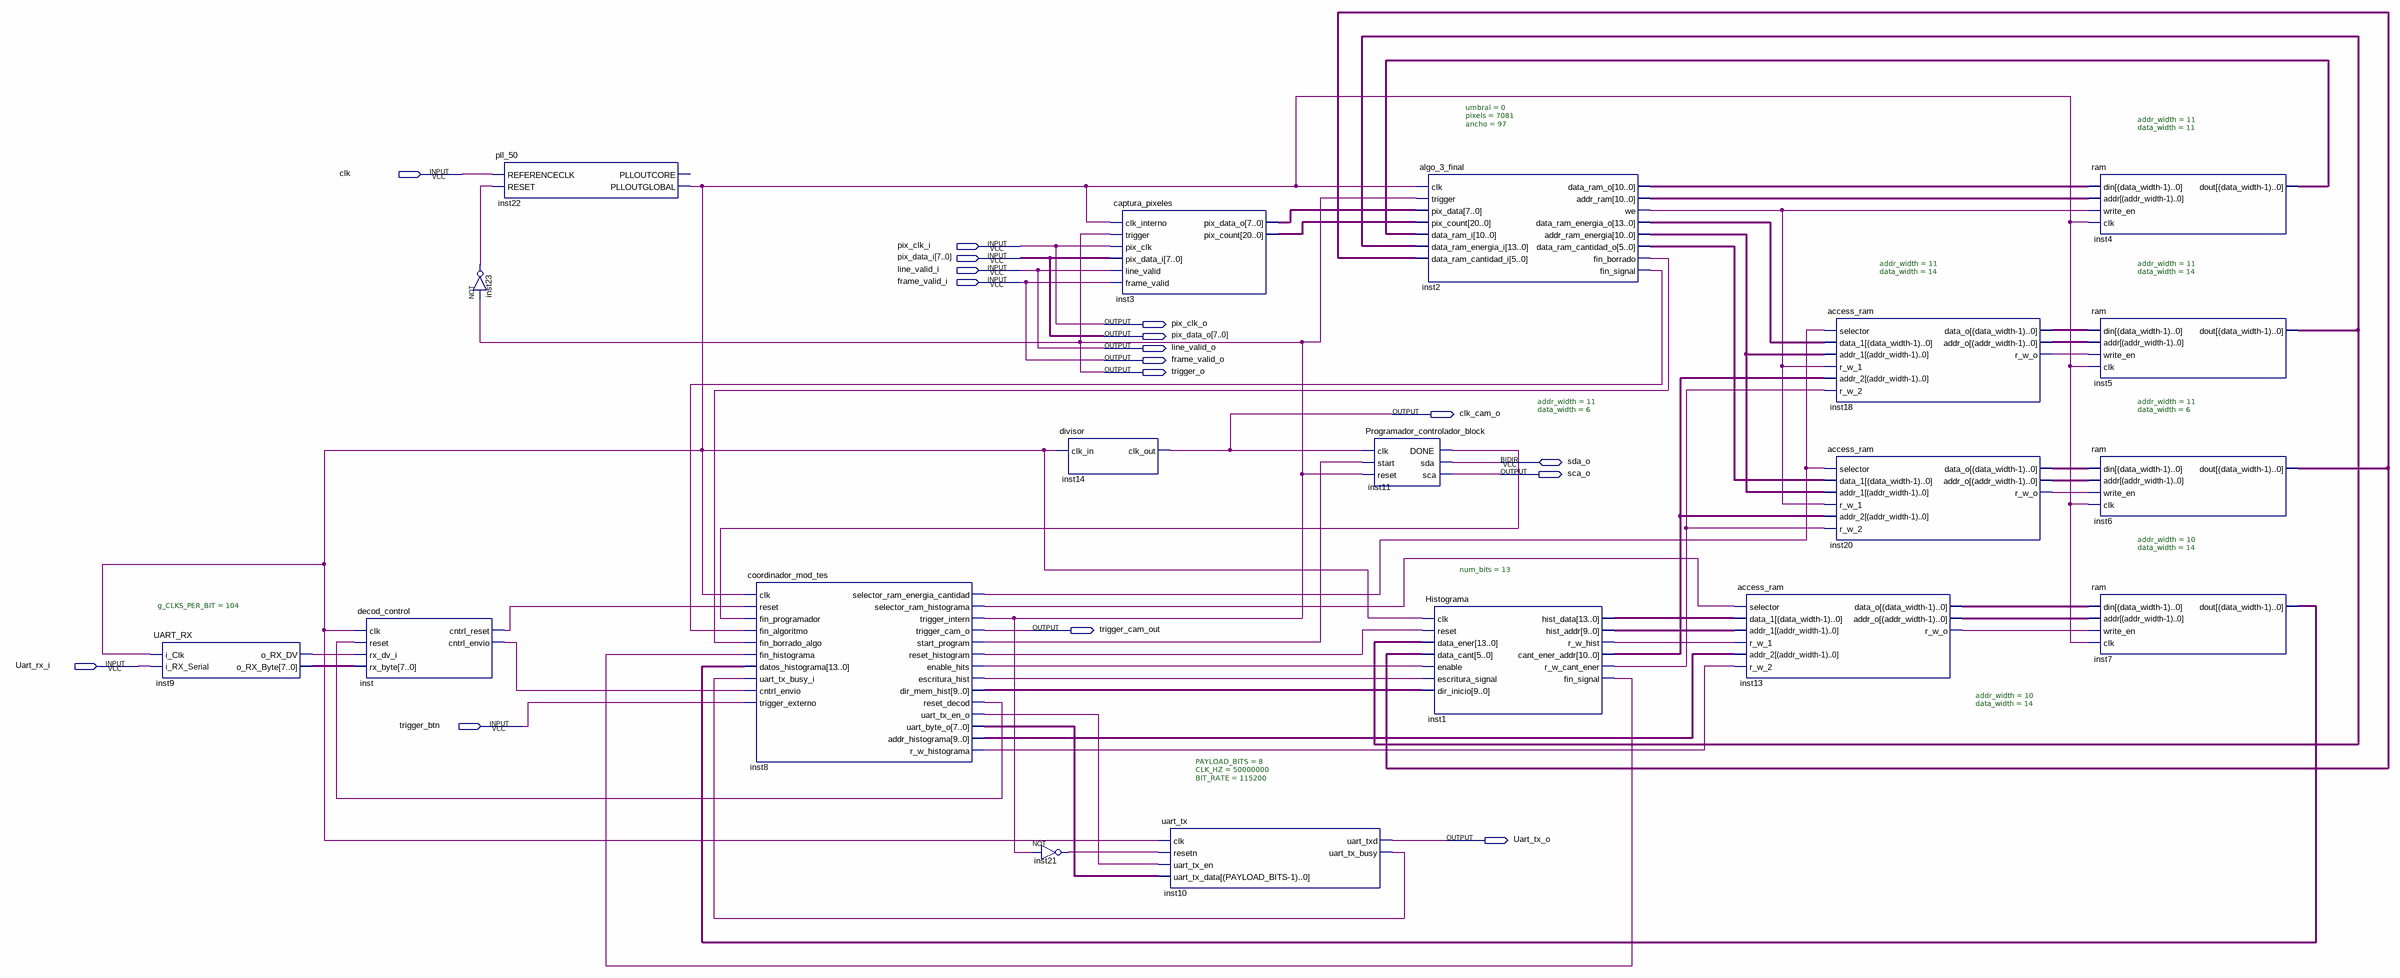
[diagram p0: schematic sheet]
// Quartus schematic test_sistema_completo.bdf as structural Verilog: 19 symbols, 17 pins
module test_sistema_completo (
  input  clk,
  input  pix_clk_i,
  input  [7:0] pix_data_i,
  input  line_valid_i,
  input  frame_valid_i,
  input  Uart_rx_i,
  input  trigger_btn,
  inout  sda_o,
  output pix_clk_o,
  output [7:0] pix_data_o,
  output line_valid_o,
  output frame_valid_o,
  output trigger_o,
  output clk_cam_o,
  output sca_o,
  output trigger_cam_out,
  output Uart_tx_o
);

  wire inst1_fin_signal, inst1_r_w_cant_ener, inst1_r_w_hist, inst2_fin_borrado, inst2_fin_signal, inst2_we,
       inst8_enable_hits, inst8_escritura_hist, inst8_r_w_histograma, inst8_reset_decod,
       inst8_reset_histogram, inst8_selector_ram_energia_cantidad, inst8_selector_ram_histograma,
       inst8_start_program, inst8_uart_tx_en_o, inst9_o_rx_dv, inst10_uart_tx_busy, inst11_done,
       inst13_r_w_o, inst18_r_w_o, inst20_r_w_o, inst21_out, inst22_plloutglobal, inst23_out,
       inst_cntrl_envio, inst_cntrl_reset;
  wire [5:0] inst2_data_ram_cantidad_o, inst6_dout, inst20_data_o;
  wire [7:0] inst3_pix_data_o, inst8_uart_byte_o, inst9_o_rx_byte;
  wire [9:0] inst1_hist_addr, inst8_addr_histograma, inst8_dir_mem_hist, inst13_addr_o;
  wire [10:0] inst1_cant_ener_addr, inst2_addr_ram, inst2_addr_ram_energia, inst2_data_ram_o, inst4_dout,
       inst18_addr_o, inst20_addr_o;
  wire [13:0] inst1_hist_data, inst2_data_ram_energia_o, inst5_dout, inst7_dout, inst13_data_o, inst18_data_o;
  wire [20:0] inst3_pix_count;

  UART_RX #(.g_CLKS_PER_BIT(104)) inst9 (
    .i_Clk(inst22_plloutglobal), .i_RX_Serial(Uart_rx_i), .o_RX_DV(inst9_o_rx_dv), .o_RX_Byte(inst9_o_rx_byte));
  decod_control inst (
    .clk(inst22_plloutglobal), .reset(inst8_reset_decod), .rx_dv_i(inst9_o_rx_dv), .rx_byte(inst9_o_rx_byte),
    .cntrl_reset(inst_cntrl_reset), .cntrl_envio(inst_cntrl_envio));
  pll_50 inst22 (.REFERENCECLK(clk), .RESET(inst23_out), .PLLOUTGLOBAL(inst22_plloutglobal));  // open: PLLOUTCORE
  not inst23 (inst23_out, trigger_o);
  coordinador_mod_tes inst8 (
    .clk(inst22_plloutglobal), .reset(inst_cntrl_reset), .fin_programador(inst11_done),
    .fin_algoritmo(inst2_fin_signal), .fin_borrado_algo(inst2_fin_borrado),
    .fin_histograma(inst1_fin_signal), .datos_histograma(inst7_dout), .uart_tx_busy_i(inst10_uart_tx_busy),
    .cntrl_envio(inst_cntrl_envio), .trigger_externo(trigger_btn),
    .selector_ram_energia_cantidad(inst8_selector_ram_energia_cantidad),
    .selector_ram_histograma(inst8_selector_ram_histograma), .trigger_intern(trigger_o),
    .trigger_cam_o(trigger_cam_out), .start_program(inst8_start_program),
    .reset_histogram(inst8_reset_histogram), .enable_hits(inst8_enable_hits),
    .escritura_hist(inst8_escritura_hist), .dir_mem_hist(inst8_dir_mem_hist),
    .reset_decod(inst8_reset_decod), .uart_tx_en_o(inst8_uart_tx_en_o), .uart_byte_o(inst8_uart_byte_o),
    .addr_histograma(inst8_addr_histograma), .r_w_histograma(inst8_r_w_histograma));
  divisor inst14 (.clk_in(inst22_plloutglobal), .clk_out(clk_cam_o));
  not inst21 (inst21_out, trigger_o);
  captura_pixeles inst3 (
    .clk_interno(inst22_plloutglobal), .trigger(trigger_o), .pix_clk(pix_clk_i), .pix_data_i(pix_data_i),
    .line_valid(line_valid_i), .frame_valid(frame_valid_i), .pix_data_o(inst3_pix_data_o),
    .pix_count(inst3_pix_count));
  uart_tx #(.PAYLOAD_BITS(8), .CLK_HZ(50000000), .BIT_RATE(115200)) inst10 (
    .clk(inst22_plloutglobal), .resetn(inst21_out), .uart_tx_en(inst8_uart_tx_en_o),
    .uart_tx_data(inst8_uart_byte_o), .uart_txd(Uart_tx_o), .uart_tx_busy(inst10_uart_tx_busy));
  Programador_controlador_block inst11 (
    .clk(clk_cam_o), .start(inst8_start_program), .reset(trigger_o), .DONE(inst11_done), .sca(sca_o),
    .sda(sda_o));
  algo_3_final #(.umbral(0), .pixels(7081), .ancho(97)) inst2 (
    .clk(inst22_plloutglobal), .trigger(trigger_o), .pix_data(inst3_pix_data_o), .pix_count(inst3_pix_count),
    .data_ram_i(inst4_dout), .data_ram_energia_i(inst5_dout), .data_ram_cantidad_i(inst6_dout),
    .data_ram_o(inst2_data_ram_o), .addr_ram(inst2_addr_ram), .we(inst2_we),
    .data_ram_energia_o(inst2_data_ram_energia_o), .addr_ram_energia(inst2_addr_ram_energia),
    .data_ram_cantidad_o(inst2_data_ram_cantidad_o), .fin_borrado(inst2_fin_borrado),
    .fin_signal(inst2_fin_signal));
  Histograma #(.num_bits(13)) inst1 (
    .clk(inst22_plloutglobal), .reset(inst8_reset_histogram), .data_ener(inst5_dout), .data_cant(inst6_dout),
    .enable(inst8_enable_hits), .escritura_signal(inst8_escritura_hist), .dir_inicio(inst8_dir_mem_hist),
    .hist_data(inst1_hist_data), .hist_addr(inst1_hist_addr), .r_w_hist(inst1_r_w_hist),
    .cant_ener_addr(inst1_cant_ener_addr), .r_w_cant_ener(inst1_r_w_cant_ener), .fin_signal(inst1_fin_signal));
  access_ram #(.addr_width(10), .data_width(14)) inst13 (
    .selector(inst8_selector_ram_histograma), .data_1(inst1_hist_data), .addr_1(inst1_hist_addr),
    .r_w_1(inst1_r_w_hist), .addr_2(inst8_addr_histograma), .r_w_2(inst8_r_w_histograma),
    .data_o(inst13_data_o), .addr_o(inst13_addr_o), .r_w_o(inst13_r_w_o));
  access_ram #(.addr_width(11), .data_width(14)) inst18 (
    .selector(inst8_selector_ram_energia_cantidad), .data_1(inst2_data_ram_energia_o),
    .addr_1(inst2_addr_ram_energia), .r_w_1(inst2_we), .addr_2(inst1_cant_ener_addr),
    .r_w_2(inst1_r_w_cant_ener), .data_o(inst18_data_o), .addr_o(inst18_addr_o), .r_w_o(inst18_r_w_o));
  access_ram #(.addr_width(11), .data_width(6)) inst20 (
    .selector(inst8_selector_ram_energia_cantidad), .data_1(inst2_data_ram_cantidad_o),
    .addr_1(inst2_addr_ram_energia), .r_w_1(inst2_we), .addr_2(inst1_cant_ener_addr),
    .r_w_2(inst1_r_w_cant_ener), .data_o(inst20_data_o), .addr_o(inst20_addr_o), .r_w_o(inst20_r_w_o));
  ram #(.addr_width(11), .data_width(11)) inst4 (
    .din(inst2_data_ram_o), .addr(inst2_addr_ram), .write_en(inst2_we), .clk(inst22_plloutglobal),
    .dout(inst4_dout));
  ram #(.addr_width(11), .data_width(14)) inst5 (
    .din(inst18_data_o), .addr(inst18_addr_o), .write_en(inst18_r_w_o), .clk(inst22_plloutglobal),
    .dout(inst5_dout));
  ram #(.addr_width(11), .data_width(6)) inst6 (
    .din(inst20_data_o), .addr(inst20_addr_o), .write_en(inst20_r_w_o), .clk(inst22_plloutglobal),
    .dout(inst6_dout));
  ram #(.addr_width(10), .data_width(14)) inst7 (
    .din(inst13_data_o), .addr(inst13_addr_o), .write_en(inst13_r_w_o), .clk(inst22_plloutglobal),
    .dout(inst7_dout));

  assign frame_valid_o = frame_valid_i;
  assign line_valid_o = line_valid_i;
  assign pix_clk_o = pix_clk_i;
  assign pix_data_o = pix_data_i;
endmodule
